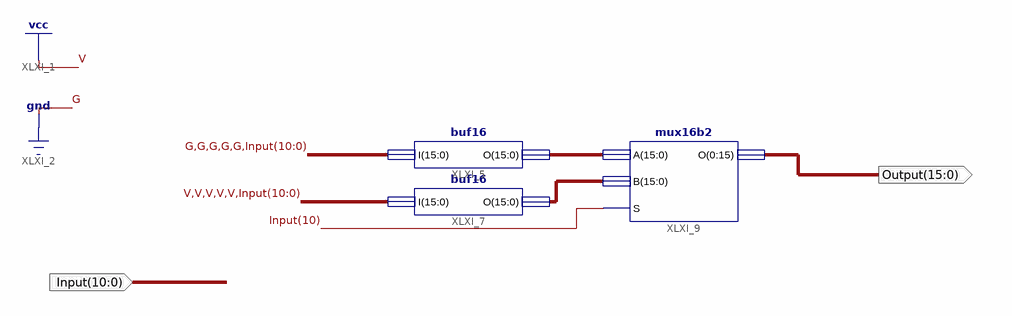
[diagram p0: schematic sheet 1]
// Xilinx ISE schematic Sign_Extended.sch (spartan3e) as structural Verilog: 3 symbols, 2 ports
module Sign_Extended (
  input  [10:0] Input,
  output [15:0] Output
);

  wire [15:0] XLXN_17, XLXN_18;

  buf16 XLXI_5 (.I({{5{1'b0}}, Input}), .O(XLXN_17));
  buf16 XLXI_7 (.I({{5{1'b1}}, Input}), .O(XLXN_18));
  mux16b2 XLXI_9 (.A(XLXN_17), .B(XLXN_18), .S(Input[10]), .O(Output));
endmodule
